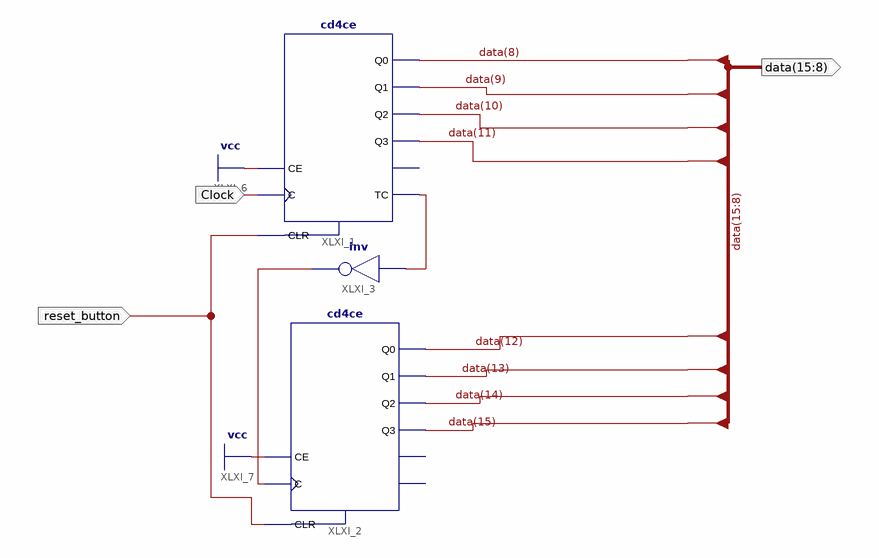
[diagram p0: schematic sheet 1]
// Xilinx ISE schematic counter00to99.sch (spartan6) as structural Verilog: 3 symbols, 3 ports
module counter00to99 (
  input  reset_button,
  input  Clock,
  output [15:8] data
);

  wire XLXN_2, XLXN_3;

  cd4ce XLXI_1 (
    .C(Clock), .CE(1'b1), .CLR(reset_button), .Q0(data[8]), .Q1(data[9]), .Q2(data[10]), .Q3(data[11]),
    .TC(XLXN_2));  // open: CEO
  cd4ce XLXI_2 (
    .C(XLXN_3), .CE(1'b1), .CLR(reset_button), .Q0(data[12]), .Q1(data[13]), .Q2(data[14]), .Q3(data[15]));  // open: CEO, TC
  not XLXI_3 (XLXN_3, XLXN_2);
endmodule
